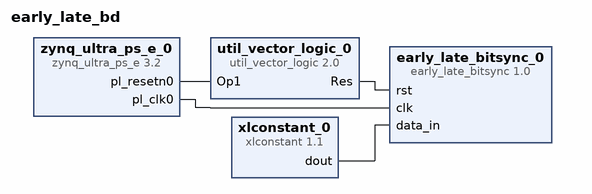
[diagram p0: block diagram of the top level]
# Vivado block design early_late_bd, xczu28dr-ffvg1517-2-e, Vivado 2018.3
create_bd_design early_late_bd

create_bd_cell -type ip -vlnv xilinx.com:ip:zynq_ultra_ps_e:3.2 zynq_ultra_ps_e_0
set_property -dict {CONFIG.PSU__DDR_HIGH_ADDRESS_GUI_ENABLE 0 CONFIG.PSU__USE__M_AXI_GP2 0} [get_bd_cells zynq_ultra_ps_e_0]
# 2 more settings of zynq_ultra_ps_e_0 are not shown: defaults, MIO pin electricals, DDR timing, and values the tool derives
create_bd_cell -type ip -vlnv xilinx.com:ip:util_vector_logic:2.0 util_vector_logic_0
set_property -dict {CONFIG.C_OPERATION not CONFIG.C_SIZE 1} [get_bd_cells util_vector_logic_0]
create_bd_cell -type ip -vlnv xilinx.com:user:early_late_bitsync:1.0 early_late_bitsync_0
create_bd_cell -type ip -vlnv xilinx.com:ip:xlconstant:1.1 xlconstant_0
set_property -dict {CONFIG.CONST_WIDTH 8} [get_bd_cells xlconstant_0]

# ---- connections ----

connect_bd_net [get_bd_pins zynq_ultra_ps_e_0/pl_resetn0] [get_bd_pins util_vector_logic_0/Op1]
connect_bd_net [get_bd_pins zynq_ultra_ps_e_0/pl_clk0] [get_bd_pins early_late_bitsync_0/clk]
connect_bd_net [get_bd_pins util_vector_logic_0/Res] [get_bd_pins early_late_bitsync_0/rst]
connect_bd_net [get_bd_pins xlconstant_0/dout] [get_bd_pins early_late_bitsync_0/data_in]

validate_bd_design
save_bd_design
